# EAGLE design Xbee Footprint -- BLE -- HM-10 -- Breakout v0.9.4 (EAGLE 6.4)
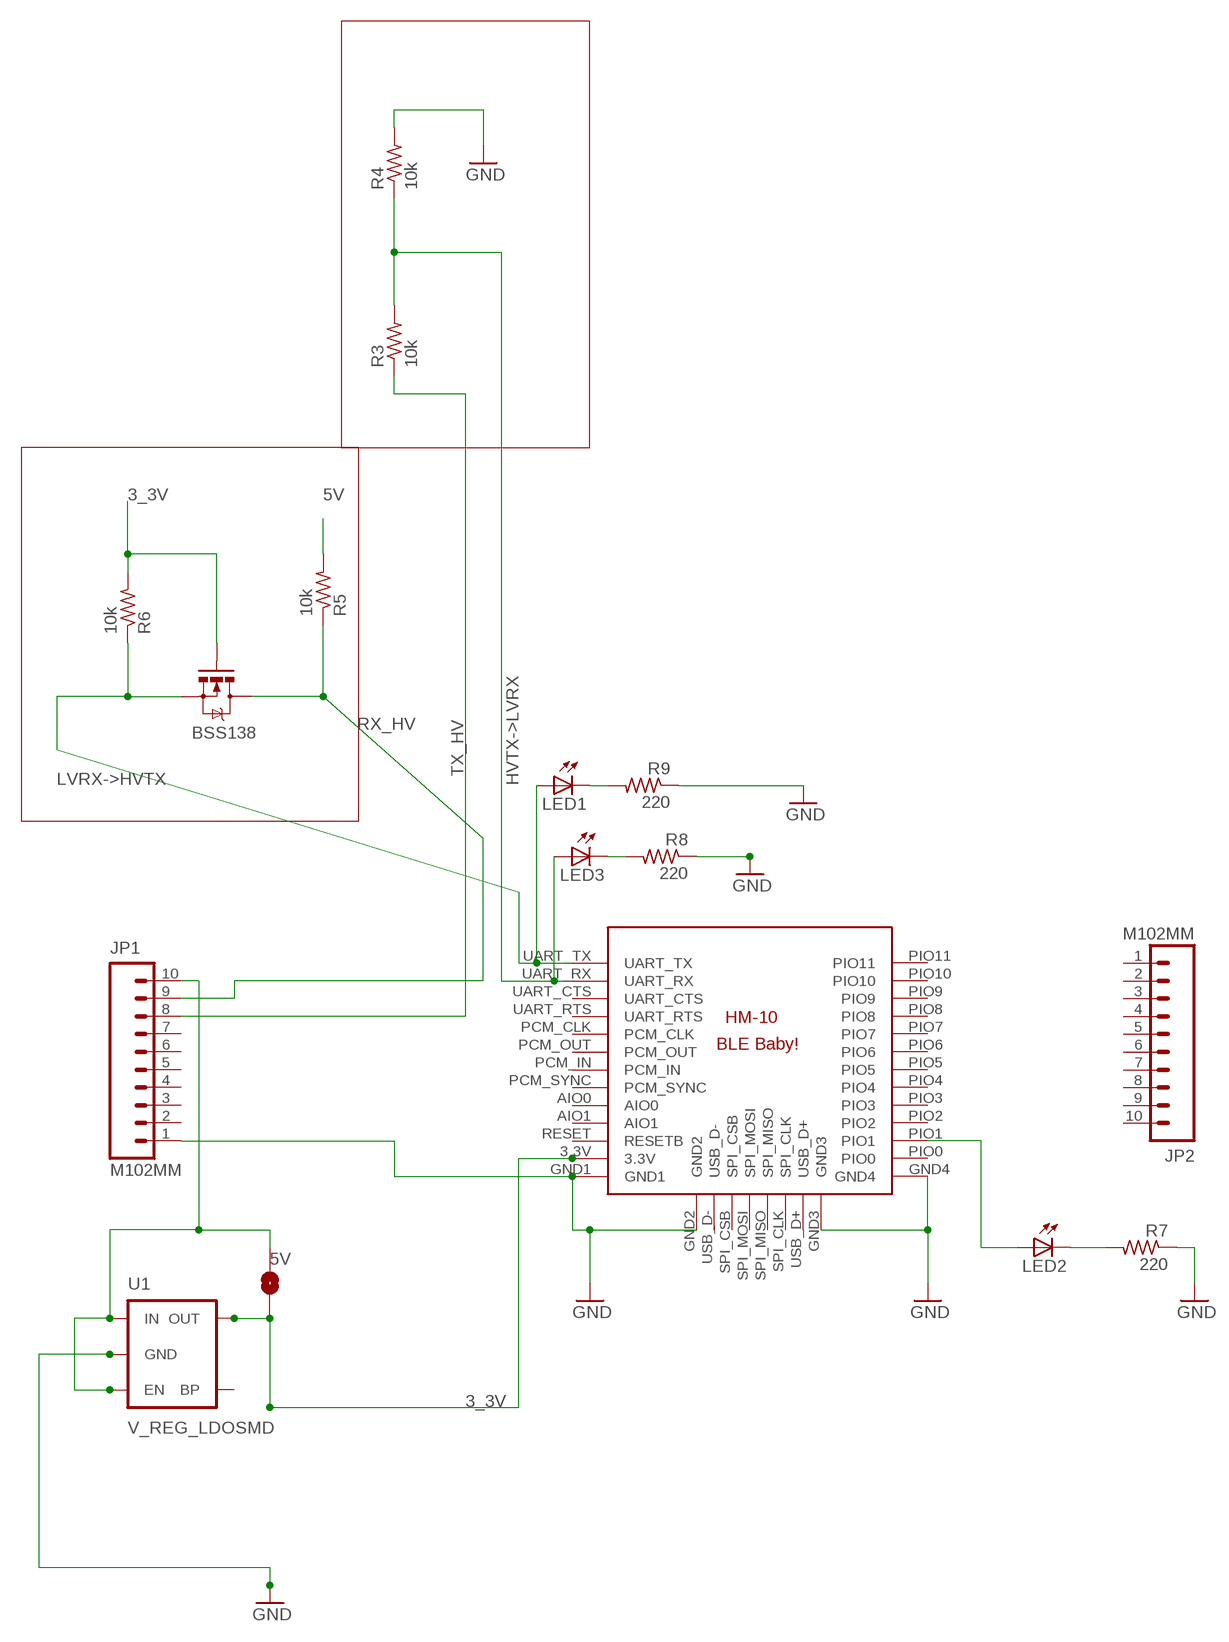
[diagram p0: schematic, sheet 1]

## Parts
BSS138  MOSFET-NCHANNELSMD  [SOT23-3]
JP1  M102MM  [1X10-2MM]
JP2  M102MM  [1X10-2MM]
LED1  LED0603  [LED-0603]
LED2  LED0603  [LED-0603]
LED3  LED0603  [LED-0603]
R3  10k  R-US_M0805  [M0805]
R4  10k  R-US_M0805  [M0805]
R5  10k  R-US_M0805  [M0805]
R6  10k  R-US_M0805  [M0805]
R7  220  R-US_M0805  [M0805]
R8  220  R-US_M0805  [M0805]
R9  220  R-US_M0805  [M0805]
SJ1  SOLDERJUMPERNO  [SJ_2S-NO]
U1  V_REG_LDOSMD  [SOT23-5]
U$1  BLE-HM-10  [BLE-HM-10]

## Nets
3_3V: BSS138.1(G) R6.2 SJ1.1 U1.5(OUT) U$1.3.3V
5V: JP1.10 R5.2 SJ1.2 U1.1(IN) U1.3(EN)
GND: JP1.1 R4.2 R7.1 R8.1 R9.1 U1.2(GND) U$1.GND1 U$1.GND2 U$1.GND3 U$1.GND4
HVTX->LVRX: LED3.A R3.2 R4.1 U$1.UART_RX
LVRX->HVTX: BSS138.2(S) LED1.A R6.1 U$1.UART_TX
N$2: LED2.A U$1.PIO1
N$26: LED2.C R7.2
N$34: LED1.C R9.2
N$35: LED3.C R8.2
RX_HV: BSS138.3(D) JP1.9 R5.1
TX_HV: JP1.8 R3.1
Unconnected: JP1.2 JP1.3 JP1.4 JP1.5 JP1.6 JP1.7 JP2.1 JP2.2 JP2.3 JP2.4 JP2.5 JP2.6 JP2.7 JP2.8 JP2.9 JP2.10 U1.4(BP) U$1.AIO0 U$1.AIO1 U$1.PCM_CLK U$1.PCM_IN U$1.PCM_OUT U$1.PCM_SYNC U$1.PIO0 U$1.PIO2 U$1.PIO3 U$1.PIO4 U$1.PIO5 U$1.PIO6 U$1.PIO7 U$1.PIO8 U$1.PIO9 U$1.PIO10 U$1.PIO11 U$1.RESET(RESETB) U$1.SPI_CLK U$1.SPI_CSB U$1.SPI_MISO U$1.SPI_MOSI U$1.UART_CTS U$1.UART_RTS U$1.USB_D+ U$1.USB_D-

## Library data of the parts
BSS138 = SparkFun:MOSFET-NCHANNEL
JP1 JP2 = SparkFun:M10: Header 10 Standard 10-pin 0.1" header. Use with straight break away headers (SKU : PRT-00116), right angle break away headers (PRT-00553), swiss pins (PRT-00743), machine pins (PRT-00117), and female headers (PRT-00115).
LED1-LED3 = SparkFun:LED: LEDs Standard schematic elements and footprints for 5mm, 3mm, 1206, and 0603 sized LEDs. 5mm - Spark Fun Electronics SKU : COM-00529 (and others)
R3-R9 = resistor:R-US_: RESISTOR, American symbol
SJ1 = SparkFun:SOLDERJUMPER: Solder Jumper Standard SMD solder jumper. Used to automate production. Two varients : Normally Open and Normally Closed are the same, but have different paste layers. NC will have a large amount of paste and should jumper during reflow.
U1 = SparkFun:V_REG_LDO: Voltage Regulator LDO Standard 150mA LDO voltage regulator in SOT-23 layout. Micrel part MIC5205. BP (by-pass) pin is used to lower output noise with 470pF cap.
U$1 = Random parts:BLE-HM-10

## Board
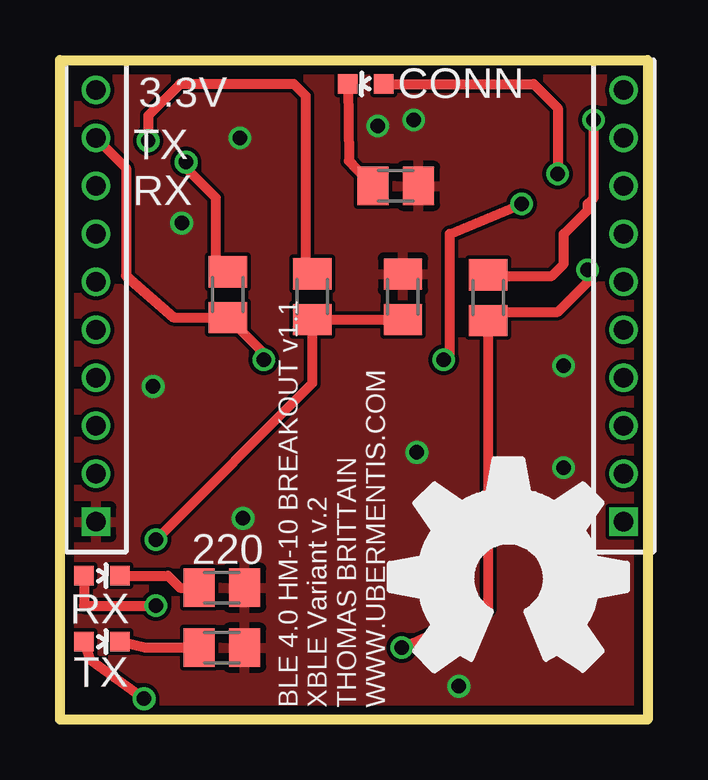
[diagram p1: board, top side]
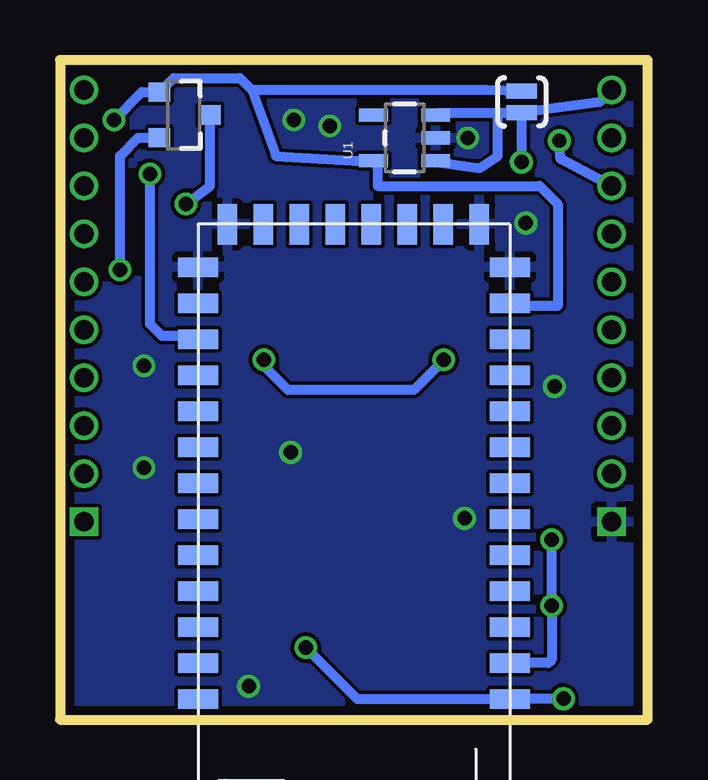
[diagram p2: board, bottom side, seen from below]

Size 24.5 x 27.5 mm. Coordinates in mm from the lower left corner, seen from the top.
Outline: 0,0 0,27.5 24.5,27.5 24.5,0 0,0
Copper layers (1*16): Top 0.0356mm / dielectric 1.5011mm / Bottom 0.0356mm
Design rules "LaenPCBOrder *": minimum track width 12mil, minimum drill 13mil, track to track 6mil, track to pad 6mil, pad to pad 6mil, via to via 6mil, smd to smd 6mil, copper to edge 15mil, drill to drill 6mil, minimum pad ring 7mil, minimum via ring 7mil, stop-mask expansion 4mil, vias tented up to drill 0mil, thermal gap 10mil

### Footprints (pad centres in the part's own frame; a part is rotated, then mirrored left to right if it is on the bottom)
SOT23-3 = smd 0.8 x 0.9: 1 -0.95,-1; 2 0.95,-1; 3 0,1.1
1X10-2MM = drill 0.8 square: 1 0,0 | drill 0.8: 2 2,0; 3 4,0; 4 6,0; 5 8,0; 6 10,0; 7 12,0; 8 14,0; 9 16,0; 10 18,0
LED-0603 = smd 0.8 x 0.8: A 0,-0.75; C 0,0.75
M0805 = smd 1.3 x 1.6: 1 -0.95,0; 2 0.95,0
SJ_2S-NO = smd 0.635 x 1.27: 1 -0.45,0; 2 0.45,0
SOT23-5 = smd 0.55 x 1.2: 1 -0.95,-1.3; 2 0,-1.3; 3 0.95,-1.3; 4 0.95,1.3; 5 -0.95,1.3
BLE-HM-10 = smd 1.676 x 0.813: 3.3V 0,3.29; AIO0 0,7.79; AIO1 0,6.29; GND1 0,1.79; GND4 13,1.79; PCM_CLK 0,13.79; PCM_IN 0,10.79; PCM_OUT 0,12.29; PCM_SYNC 0,9.29; PIO0 13,3.29; PIO1 13,4.79; PIO2 13,6.29; PIO3 13,7.79; PIO4 13,9.29; PIO5 13,10.79; PIO6 13,12.29; PIO7 13,13.79; PIO8 13,15.29; PIO9 13,16.79; PIO10 13,18.29; PIO11 13,19.79; RESET 0,4.79; UART_CTS 0,16.79; UART_RTS 0,15.29; UART_RX 0,18.29; UART_TX 0,19.79 | smd 0.813 x 1.676: GND2 1.27,0; GND3 11.77,0; SPI_CLK 8.77,0; SPI_CSB 4.27,0; SPI_MISO 7.27,0; SPI_MOSI 5.77,0; USB_D+ 10.27,0; USB_D- 2.77,0

### Placement (x,y rotation side)
BSS138  19.35,25.21 270 bottom
JP1  1.5,8.25 90 top
JP2  23.5,8.25 90 top
LED1  1.75,3.25 270 top
LED2  12.75,26.5 90 top
LED3  1.75,6 270 top
R3  10.53,17.63 270 top
R4  14.3,17.63 90 top
R5  7,17.72 90 top
R6  17.86,17.59 90 top
R7  14,22.25 180 top
R8  6.75,5.5 180 top
R9  6.75,3 180 top
SJ1  5.25,25.75 270 bottom
U1  10.13,24.25 90 bottom
U$1  5.74,20.65 180 bottom
U$2  [OSHW_FILLX350_NOTEXT]  13.74,2.02 0 top

### Tracks (layer width: path | path; a pad name or v marks a point on that pad's centre or on a via)
3_3V  (via drill 0.6)
  Top 0.406: R6.2 17.9,18.5 20.5,18.5 21,19 21,20.25 22,21.25 22,21.5 22.25,21.75 v22.25,25
  Bottom 0.406: SJ1.1 6.7,26.25 16.5,26.25 | 16.5,26.25 15.5,23.5 12.3,23.3 U1.5 11.25,23.12 11.25,22.25 4.5,22.25 3.75,21.5 3.75,17.25 5.25,17.25 5.36,17.36 U$1.3.3V | 16.5,26.25 17,26.75 19.75,26.75 BSS138.1 21.09,26.16 v22.25,25
5V  (via drill 0.6)
  Top 0.406: R5.2 6.5,19.17 6.5,21.75 5.25,23 v5.25,23.25
  Bottom 0.406: JP1.10 2,25.75 SJ1.2 | U1.3 8.73,25.3 6.25,25.3 | 6.25,25.3 SJ1.2 | U1.1 8.78,23.25 7,23 6.25,23.5 6.25,25.3 | v5.25,23.25 5.29,23.5 5.25,23.54 SJ1.2
GND  (via drill 0.6)
  other vias: 7.5,24.25 5.08,20.7 16.63,1.39 21,14.75 21,10.5 14.75,25 13.25,24.75 14.88,11.14 7.63,8.39 3.88,13.89
  pour Bottom: -0.26,0.17 24.52,0.11 24.64,27.59 -0.26,27.59
  pour Top: 24.5,27.52 -0.07,27.52 -0.07,0.25 24.5,0
HVTX->LVRX  (via drill 0.6)
  Top 0.406: LED3.A 1,4.75 v4,4.75 | v4,7.5 10.53,14.03 R3.2 R4.1
  Bottom 0.406: U$1.UART_RX 4.14,2.36 4,2.5 v4,4.75 v4,7.5
LVRX->HVTX  (via drill 0.6)
  Top 0.406: LED1.A 1.25,2.5 v3.51,0.87 | v14.25,3 17.86,4.61 R6.1 18.22,17 20.75,17 22,18.25 21.97,18.28 22,18.31 v22,18.75
  Bottom 0.406: BSS138.2 21.24,24.26 22,23.5 v22,18.75 | v3.51,0.87 3.64,0.86 U$1.UART_TX | U$1.UART_TX 5.88,1 | v14.25,3 12.11,0.86 U$1.UART_TX
N$2  (via drill 0.6)
  Top 0.406: LED2.A 19.75,26.5 20.75,25.5 v20.75,22.75
  Bottom 0.406: U$1.PIO1 18.88,16 20.25,16 20.75,16.5 v20.75,22.75
N$26
  Top 0.406: LED2.C 12.05,23.3 R7.2
N$34
  Top 0.406: R9.2 3.55,3 LED1.C
N$35
  Top 0.406: LED3.C 4.5,6 5,5.5 R8.2
RX_HV  (via drill 0.6)
  Top 0.406: v8.5,15 8.5,15.27 R5.1 4.73,16.77 2.75,18.5 2.75,23 JP1.9 | v16,15 16.25,15.25 16.25,20.25 v19.25,21.5
  Bottom 0.406: v8.5,15 9.75,13.75 15,13.75 16,14.75 v16,15 | v19.25,21.5 18.25,22.25 18.25,24.75 BSS138.3
TX_HV  (via drill 0.6)
  Top 0.406: R3.1 10.25,18.86 10.25,26 9.75,26.5 5,26.5 3.68,25.18 v3.68,24.13
  Bottom 0.406: JP1.8 3.63,23.38 v3.68,24.13

### Text on the board
tNames: 3.3V | CONN | TX | RX | 220 | RX | TX | BLE 4.0 HM-10 BREAKOUT v1.1 / XBLE Variant v.2 / THOMAS BRITTAIN / WWW.UBERMENTIS.COM